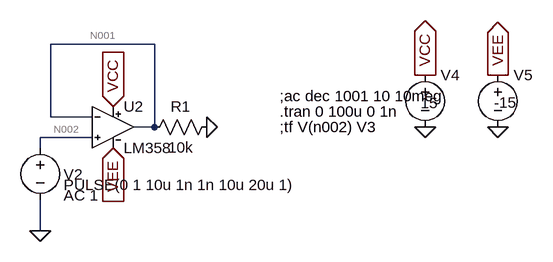
[diagram p0: schematic noinvertingAmp.asc]
noinvertingAmp.asc, the LTspice schematic file:
Version 4
SHEET 1 880 680
WIRE 48 -192 -112 -192
WIRE -112 -80 -112 -192
WIRE -48 -80 -112 -80
WIRE 48 -64 48 -192
WIRE 48 -64 16 -64
WIRE -48 -48 -128 -48
WIRE -128 -32 -128 -48
WIRE -128 96 -128 48
FLAG 464 -64 0
FLAG 576 -64 0
FLAG 464 -144 VCC
IOPIN 464 -144 Out
FLAG 576 -144 VEE
IOPIN 576 -144 Out
FLAG -16 -96 VCC
IOPIN -16 -96 In
FLAG -16 -32 VEE
IOPIN -16 -32 In
FLAG -128 96 0
FLAG 128 -64 0
SYMBOL voltage 464 -160 R0
WINDOW 123 0 0 Left 2
WINDOW 39 0 0 Left 2
WINDOW 3 -7 59 Left 2
SYMATTR Value 15
SYMATTR InstName V4
SYMBOL voltage 576 -160 R0
WINDOW 123 0 0 Left 2
WINDOW 39 0 0 Left 2
WINDOW 3 -6 58 Left 2
SYMATTR Value -15
SYMATTR InstName V5
SYMBOL AutoGenerated\\LM358 -16 -128 R0
SYMATTR InstName U2
SYMBOL voltage -128 -48 R0
WINDOW 0 36 57 Left 2
WINDOW 3 36 73 Left 2
WINDOW 123 36 89 Left 2
WINDOW 39 0 0 Left 2
SYMATTR InstName V2
SYMATTR Value PULSE(0 1 10u 1n 1n 10u 20u 1)
SYMATTR Value2 AC 1
SYMBOL res 144 -80 R90
WINDOW 0 0 56 VBottom 2
WINDOW 3 32 56 VTop 2
SYMATTR InstName R1
SYMATTR Value 10k
TEXT 240 -88 Left 2 !.tran 0 100u 0 1n
TEXT 240 -64 Left 2 !;tf V(n002) V3
TEXT 240 -112 Left 2 !;ac dec 1001 10 10meg

The netlist it stands for:
* noinvertingAmp.asc
V4 VCC 0 15
V5 VEE 0 -15
XU2 N002 N001 VCC VEE N001 LM358  ; pins In+ In- V+ V- OUT
V2 N002 0 PULSE(0 1 10u 1n 1n 10u 20u 1) AC 1
R1 0 N001 10k
.tran 0 100u 0 1n
;tf V(n002) V3
;ac dec 1001 10 10meg
.lib LM358.lib
.backanno
.end

* Results of the author's LTspice run, read from the files saved beside the schematic
* Operating Point, zero values left out:
*   V(vcc) = 15 V
*   V(vee) = -15 V
*   V(n001) = -33.66 µV
*   I(R1) = 3.366 nA
*   I(V2) = 19.92 nA
*   I(V5) = 999.7 µA
*   I(V4) = -999.8 µA
*   Ix(u2:1) = -19.92 nA
*   Ix(u2:2) = -19.93 nA
*   Ix(u2:3) = 999.8 µA
*   Ix(u2:4) = -999.7 µA
*   Ix(u2:5) = 23.3 nA
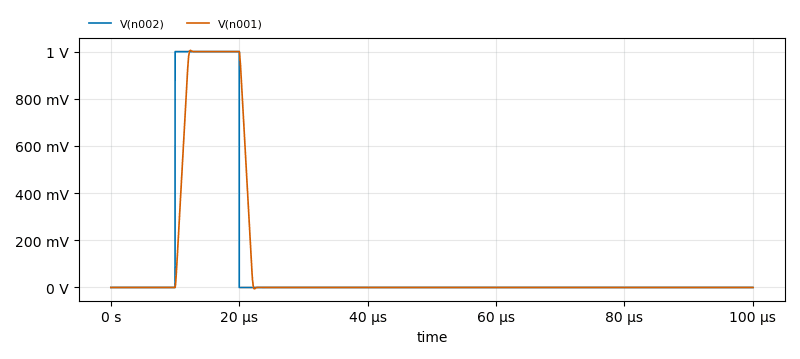
[diagram p1: Transient Analysis of noinvertingAmp.asc, plotted from the saved traces]
* Transient Analysis, 1 run:
*   V(n002): min 0 V, max 1 V, average 100 mV, rms 316.2 mV, last 0 V
*   V(n001): min -5.651 mV, max 1.005 V, average 99.93 mV, rms 305.4 mV, last -33.66 µV